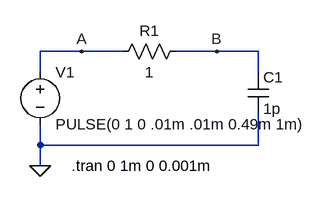
[diagram p0: schematic 2.asc]
2.asc, the LTspice schematic file:
Version 4
SHEET 1 880 680
WIRE 48 80 -16 80
WIRE 112 80 48 80
WIRE 256 80 192 80
WIRE 320 80 256 80
WIRE -16 112 -16 80
WIRE 320 112 320 80
WIRE -16 224 -16 192
WIRE 320 224 320 176
WIRE 320 224 -16 224
WIRE -16 256 -16 224
FLAG -16 256 0
FLAG 48 80 A
FLAG 256 80 B
SYMBOL cap 304 112 R0
SYMATTR InstName C1
SYMATTR Value 1p
SYMBOL res 208 64 R90
WINDOW 0 0 56 VBottom 2
WINDOW 3 32 56 VTop 2
SYMATTR InstName R1
SYMATTR Value 1
SYMBOL voltage -16 96 R0
WINDOW 123 0 0 Left 2
WINDOW 39 0 0 Left 2
SYMATTR InstName V1
SYMATTR Value PULSE(0 1 0 .01m .01m 0.49m 1m)
TEXT 32 256 Left 2 !.tran 0 1m 0 0.001m

The netlist it stands for:
* 2.asc
C1 B 0 1p
R1 B A 1
V1 A 0 PULSE(0 1 0 .01m .01m 0.49m 1m)
.tran 0 1m 0 0.001m
.backanno
.end